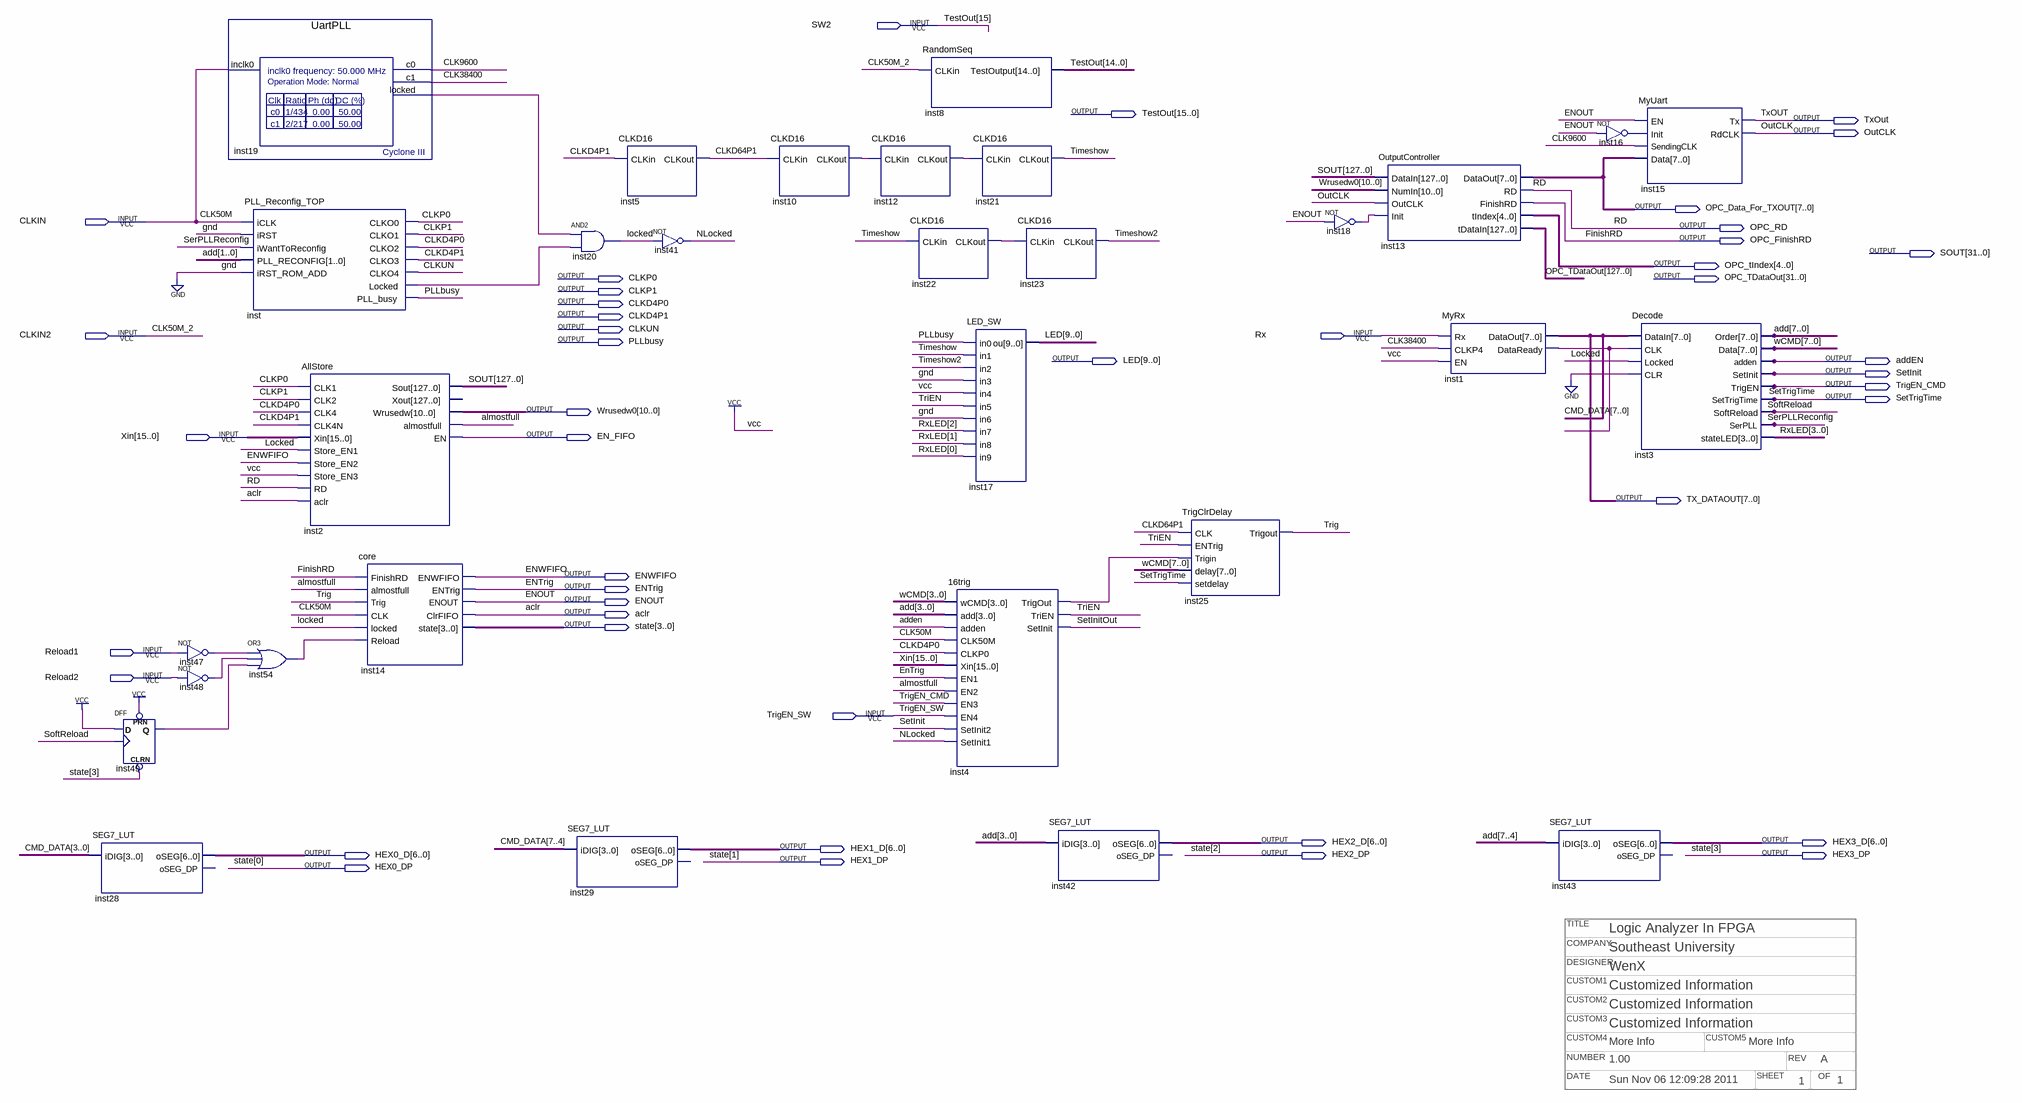
[diagram p0: schematic sheet]
// Quartus schematic Block1.bdf as structural Verilog: 30 symbols, 44 pins
// Title block: TITLE: Logic Analyzer In FPGA; COMPANY: Southeast University; DESIGNER: WenX; NUMBER: 1.00; REV: A; DATE: Sun Nov 06 12:09:28 2011; SHEET: 1; OF: 1; CUSTOM1: Customized Information; CUSTOM2: Customized Information; CUSTOM3: Customized Information; CUSTOM4: More Info; CUSTOM5: More Info
module Block1 (
  input  SW2,
  input  CLKIN,
  input  CLKIN2,
  input  Rx,
  input  [15:0] Xin,
  input  Reload1,
  input  Reload2,
  input  TrigEN_SW,
  output [15:0] TestOut,
  output TxOut,
  output OutCLK,
  output [7:0] OPC_Data_For_TXOUT,
  output OPC_RD,
  output OPC_FinishRD,
  output [127:0] SOUT,
  output [4:0] OPC_tIndex,
  output CLKP0,
  output [127:0] OPC_TDataOut,
  output CLKP1,
  output CLKD4P0,
  output CLKD4P1,
  output CLKUN,
  output PLLbusy,
  output [9:0] LED,
  output addEN,
  output SetInit,
  output TrigEN_CMD,
  output SetTrigTime,
  output [10:0] Wrusedw0,
  output EN_FIFO,
  output [7:0] TX_DATAOUT,
  output ENWFIFO,
  output ENTrig,
  output ENOUT,
  output aclr,
  output [3:0] state,
  output [6:0] HEX2_D,
  output [6:0] HEX3_D,
  output [6:0] HEX1_D,
  output [6:0] HEX0_D,
  output HEX2_DP,
  output HEX3_DP,
  output HEX1_DP,
  output HEX0_DP
);

  wire almostfull, CLK9600, CLK38400, CLKD64P1, inst1_dataready, inst4_trigout, inst10_clkout, inst12_clkout,
       inst16_out, inst18_out, inst19_locked, inst22_clkout, inst47_out, inst48_out, inst49_q, inst54_out,
       inst_locked, locked, NLocked, SerPLLReconfig, SetInitOut, SoftReload, Timeshow, Timeshow2, TriEN, Trig;
  wire [3:0] RxLED;
  wire [7:0] add, wCMD;

  SEG7_LUT inst28 (.iDIG(TX_DATAOUT[3:0]), .oSEG(HEX0_D));  // open: oSEG_DP
  DFF inst49 (.CLRN(HEX3_DP), .CLK(SoftReload), .D(1'b1), .PRN(1'b1), .Q(inst49_q));
  not inst47 (inst47_out, Reload1);
  not inst48 (inst48_out, Reload2);
  UartPLL inst19 (.inclk0(CLKIN), .c0(CLK9600), .c1(CLK38400), .locked(inst19_locked));
  PLL_Reconfig_TOP inst (
    .iCLK(CLKIN), .iRST(1'b0), .iWantToReconfig(SerPLLReconfig), .PLL_RECONFIG(add[1:0]),
    .iRST_ROM_ADD(1'b0), .CLKO0(CLKP0), .CLKO1(CLKP1), .CLKO2(CLKD4P0), .CLKO3(CLKD4P1), .CLKO4(CLKUN),
    .Locked(inst_locked), .PLL_busy(PLLbusy));
  or inst54 (inst54_out, inst47_out, inst48_out, inst49_q);
  AllStore inst2 (
    .CLK1(CLKP0), .CLK2(CLKP1), .CLK4(CLKD4P0), .CLK4N(CLKD4P1), .Xin(Xin), .Store_EN1(locked),
    .Store_EN2(ENWFIFO), .Store_EN3(1'b1), .RD(OPC_RD), .aclr(aclr), .Sout(SOUT), .Wrusedw(Wrusedw0),
    .almostfull(almostfull), .EN(EN_FIFO));  // open: Xout
  core inst14 (
    .FinishRD(OPC_FinishRD), .almostfull(almostfull), .Trig(Trig), .CLK(CLKIN), .locked(locked),
    .Reload(inst54_out), .ENWFIFO(ENWFIFO), .ENTrig(ENTrig), .ENOUT(ENOUT), .ClrFIFO(aclr),
    .state({HEX3_DP, HEX2_DP, HEX1_DP, HEX0_DP}));
  and inst20 (locked, inst19_locked, inst_locked);
  SEG7_LUT inst29 (.iDIG(TX_DATAOUT[7:4]), .oSEG(HEX1_D));  // open: oSEG_DP
  CLKD16 inst5 (.CLKin(CLKD4P1), .CLKout(CLKD64P1));
  not inst41 (NLocked, locked);
  CLKD16 inst10 (.CLKin(CLKD64P1), .CLKout(inst10_clkout));
  CLKD16 inst12 (.CLKin(inst10_clkout), .CLKout(inst12_clkout));
  CLKD16 inst22 (.CLKin(Timeshow), .CLKout(inst22_clkout));
  RandomSeq inst8 (.CLKin(CLKIN2), .TestOutput(TestOut[14:0]));
  LED_SW inst17 (
    .in0(PLLbusy), .in1(Timeshow), .in2(Timeshow2), .in3(1'b0), .in4(1'b1), .in5(TriEN), .in6(1'b0),
    .in7(RxLED[2]), .in8(RxLED[1]), .in9(RxLED[0]), .ou(LED));
  \16trig  inst4 (
    .wCMD(wCMD[3:0]), .add(add[3:0]), .adden(addEN), .CLK50M(CLKIN), .CLKP0(CLKD4P0), .Xin(Xin),
    .EN1(ENTrig), .EN2(almostfull), .EN3(TrigEN_CMD), .EN4(TrigEN_SW), .SetInit2(SetInit),
    .SetInit1(NLocked), .TrigOut(inst4_trigout), .TriEN(TriEN), .SetInit(SetInitOut));
  CLKD16 inst21 (.CLKin(inst12_clkout), .CLKout(Timeshow));
  CLKD16 inst23 (.CLKin(inst22_clkout), .CLKout(Timeshow2));
  SEG7_LUT inst42 (.iDIG(add[3:0]), .oSEG(HEX2_D));  // open: oSEG_DP
  TrigClrDelay inst25 (
    .CLK(CLKD64P1), .ENTrig(TriEN), .Trigin(inst4_trigout), .delay(wCMD), .setdelay(SetTrigTime),
    .Trigout(Trig));
  not inst18 (inst18_out, ENOUT);
  OutputController inst13 (
    .DataIn(SOUT), .NumIn(Wrusedw0), .OutCLK(OutCLK), .Init(inst18_out), .DataOut(OPC_Data_For_TXOUT),
    .RD(OPC_RD), .FinishRD(OPC_FinishRD), .tIndex(OPC_tIndex), .tDataIn(OPC_TDataOut));
  MyRx inst1 (.Rx(Rx), .CLKP4(CLK38400), .EN(1'b1), .DataOut(TX_DATAOUT), .DataReady(inst1_dataready));
  SEG7_LUT inst43 (.iDIG(add[7:4]), .oSEG(HEX3_D));  // open: oSEG_DP
  not inst16 (inst16_out, ENOUT);
  MyUart inst15 (
    .EN(ENOUT), .Init(inst16_out), .SendingCLK(CLK9600), .Data(OPC_Data_For_TXOUT), .Tx(TxOut), .RdCLK(OutCLK));
  Decode inst3 (
    .DataIn(TX_DATAOUT), .CLK(inst1_dataready), .Locked(locked), .CLR(1'b0), .Order(add), .Data(wCMD),
    .adden(addEN), .SetInit(SetInit), .TrigEN(TrigEN_CMD), .SetTrigTime(SetTrigTime),
    .SoftReload(SoftReload), .SerPLL(SerPLLReconfig), .stateLED(RxLED));

  assign state = {HEX3_DP, HEX2_DP, HEX1_DP, HEX0_DP};
  assign TestOut[15] = SW2;

  // Other names for the same wires on the sheet: CLK50M_2 = CLKIN2; CLK50M = CLKIN; FinishRD = OPC_FinishRD;
  //   RD = OPC_RD; CMD_DATA[7:0] = TX_DATAOUT
endmodule
